# EAGLE design BARBOT (EAGLE 8.6.1)
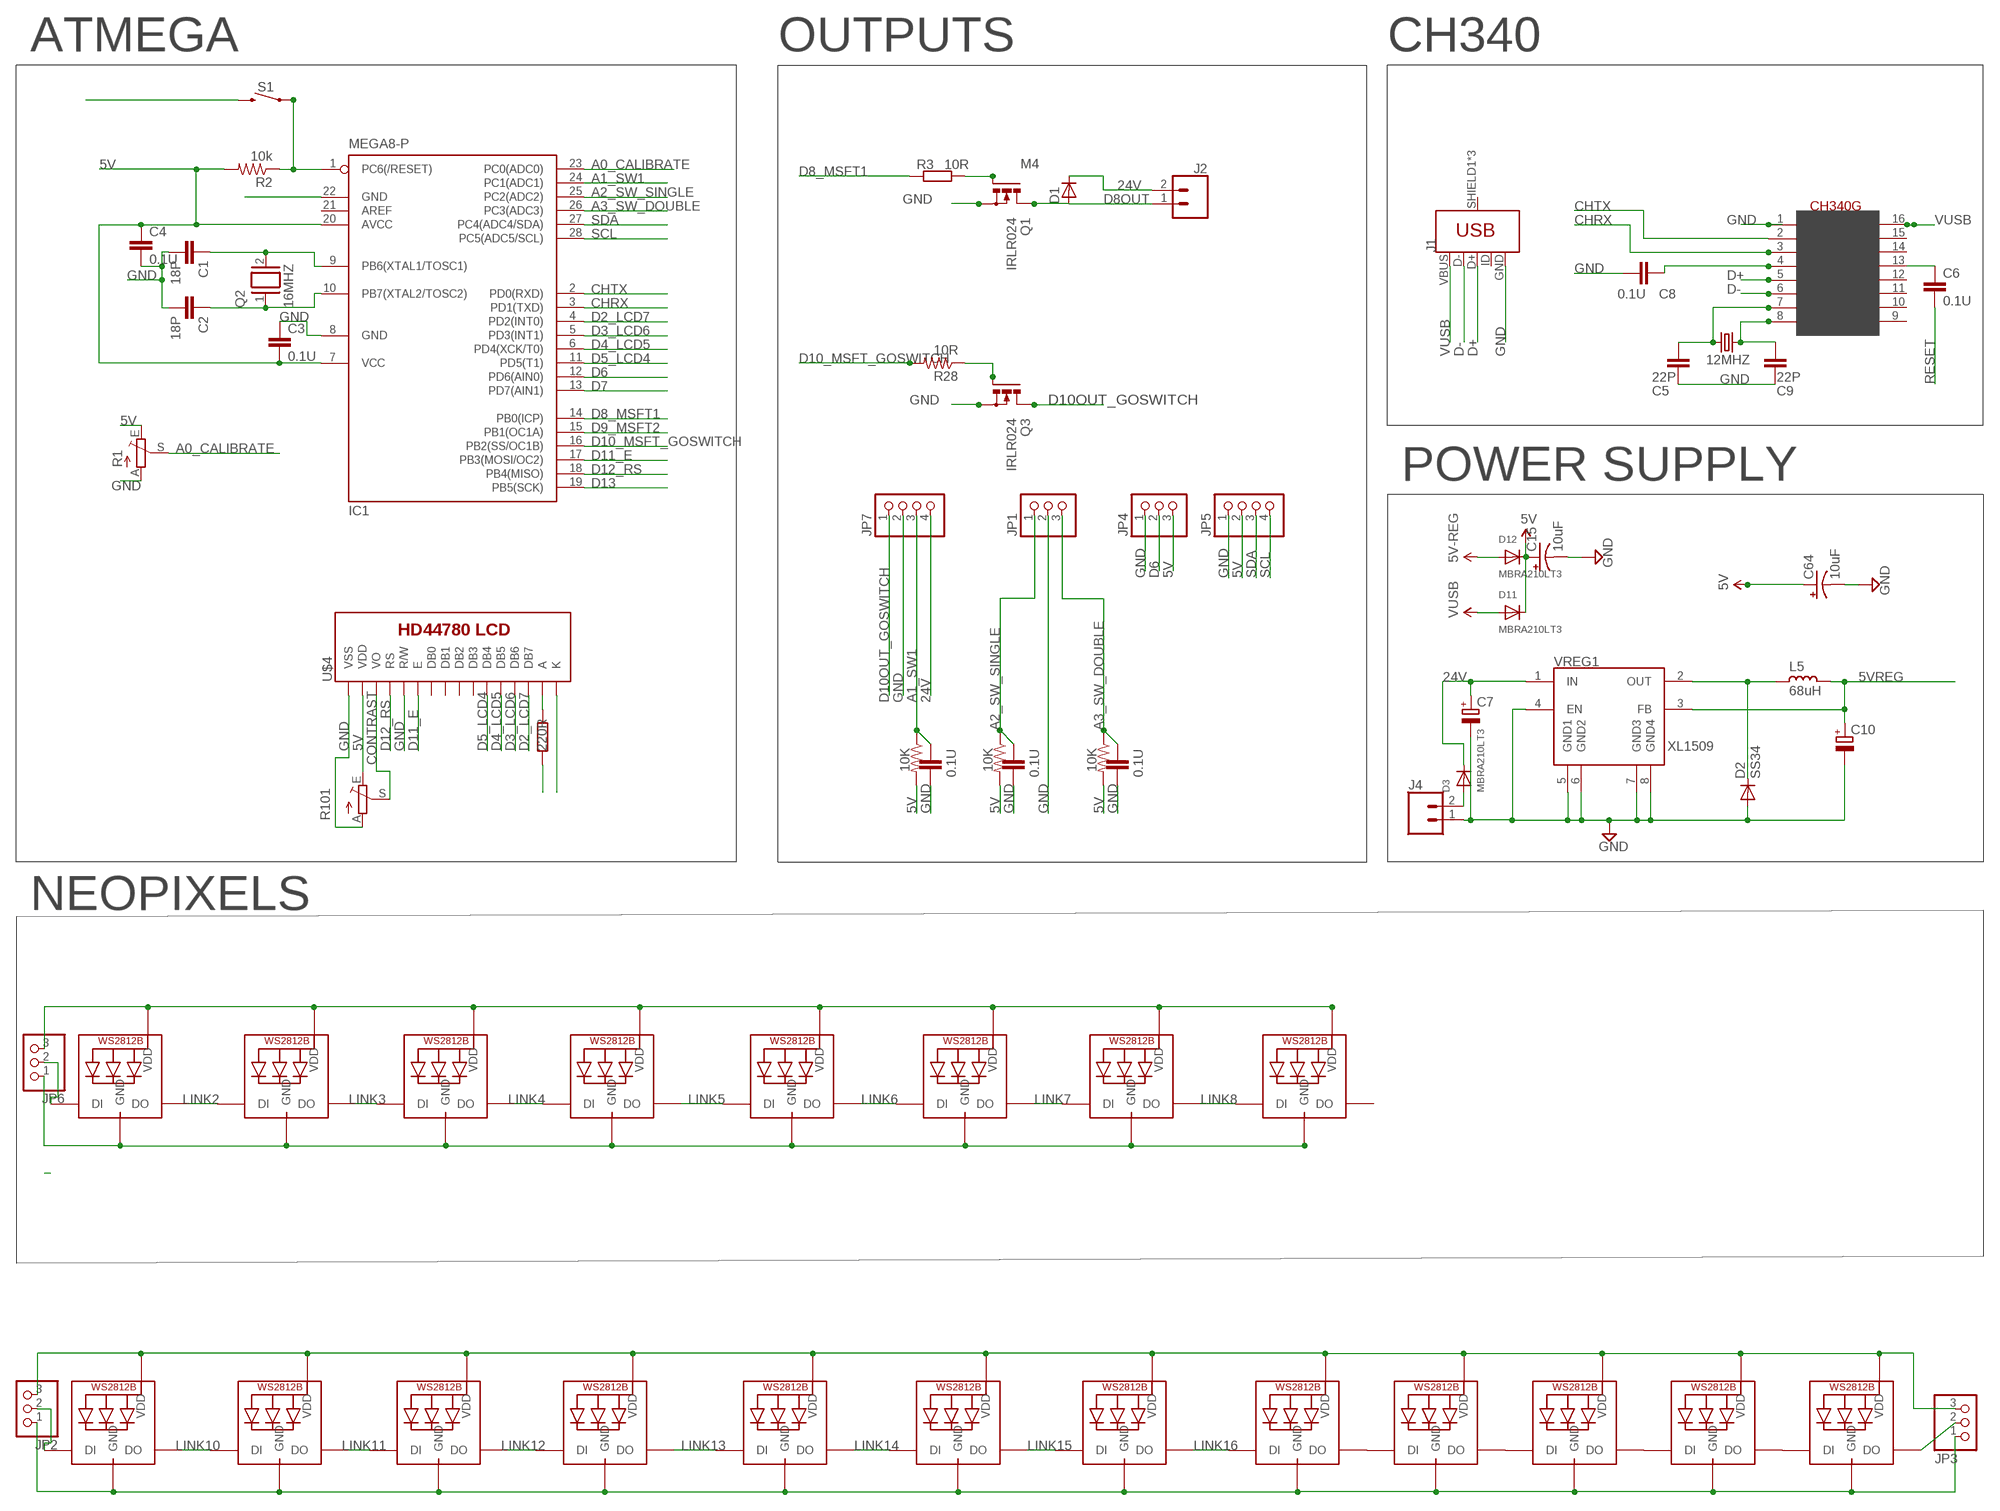
[diagram p0: schematic, sheet 1]

## Parts
12MHZ  12MHZ  CRYSTALHC49U70  [HC49U70]
C1  18P  C-EUC1206  [C1206]
C2  18P  C-EUC1206  [C1206]
C3  0.1U  C-EUC1206  [C1206]
C4  0.1U  C-EUC1206  [C1206]
C5  22P  C-EUC1206  [C1206]
C6  0.1U  C-EUC1206  [C1206]
C7  CPOL-EUE3.5-10  [E3,5-10]
C8  0.1U  C-EUC1206  [C1206]
C9  22P  C-EUC1206  [C1206]
C10  CPOL-EUE3.5-10  [E3,5-10]
C11  0.1U  C-EUC1206  [C1206]
C12  0.1U  C-EUC1206  [C1206]
C13  0.1U  C-EUC1206  [C1206]
C15  10uF  CAP_POL1206  [EIA3216]
C64  10uF  CAP_POL1206  [EIA3216]
D1  M4  D-SOD-80  [SOD80]
D2  SS34  DIODE-DO-214AC  [DO-214AC]
D3  MBRA210LT3  DIODESMA  [SMADIODE]
D11  MBRA210LT3  DIODESMA  [SMADIODE]
D12  MBRA210LT3  DIODESMA  [SMADIODE]
IC1  MEGA8-P  [DIL28-3]
J1  USB_MICRO-BREDUCED_PASTE  [USB-B-MICRO-SMD_RED_PASTE]
J2  CONN_023.5MM  [SCREWTERMINAL-3.5MM-2]
J4  CONN_023.5MM  [SCREWTERMINAL-3.5MM-2]
JP1  PINHD-1X3  [1X03]
JP2  PINHD-1X3  [1X03]
JP3  PINHD-1X3  [1X03]
JP4  PINHD-1X3  [1X03]
JP5  PINHD-1X4  [1X04]
JP6  PINHD-1X3  [1X03]
JP7  PINHD-1X4  [1X04]
L5  68uH  L_CD75  [CD75]
LED1  WS2812B5050  [WS2812B]
LED2  WS2812B5050  [WS2812B]
LED3  WS2812B5050  [WS2812B]
LED4  WS2812B5050  [WS2812B]
LED5  WS2812B5050  [WS2812B]
LED6  WS2812B5050  [WS2812B]
LED7  WS2812B5050  [WS2812B]
LED8  WS2812B5050  [WS2812B]
LED9  WS2812B5050  [WS2812B]
LED10  WS2812B5050  [WS2812B]
LED11  WS2812B5050  [WS2812B]
LED12  WS2812B5050  [WS2812B]
LED13  WS2812B5050  [WS2812B]
LED14  WS2812B5050  [WS2812B]
LED15  WS2812B5050  [WS2812B]
LED16  WS2812B5050  [WS2812B]
LED17  WS2812B5050  [WS2812B]
LED18  WS2812B5050  [WS2812B]
LED19  WS2812B5050  [WS2812B]
LED20  WS2812B5050  [WS2812B]
Q1  IRLR024  N-POWER-MOSFETDPAK-MOSFET  [D-PAK_TO252AA]
Q2  16MHZ  XTAL/S  [QS]
Q3  IRLR024  N-POWER-MOSFETDPAK-MOSFET  [D-PAK_TO252AA]
R1  TRIM_EU-B25P  [B25P]
R2  10k  R-US_R1206  [R1206]
R3  10R  R-EU_R1206  [R1206]
R4  220R  R-EU_R1206  [R1206]
R5  10K  R-US_R1206  [R1206@1]
R6  10K  R-US_R1206  [R1206@1]
R7  10K  R-US_R1206  [R1206@1]
R28  10R  R-US_R1206  [R1206@1]
R101  TRIM_EU-B25P  [B25P]
S1  MOMENTARY-SWITCH-SPST-PTH-RIGHT-ANGLE-KIT  [TACTILE_SWITCH_PTH_RIGHT_ANGLE_KIT]
U$2  CH340G  [SOIC16]
U$4  LCD-HD447804-HOLES16X2-4-HOLES  [LCD-16X2-4HOLES]
VREG1  XL1509  [SO08]

## Nets
5V: C3.2 C4.1 C15.A(+) C64.A(+) D11.C D12.C IC1.7(VCC) IC1.20(AVCC) JP4.3 JP5.2 JP6.3 LED1.1-VDD(VDD) LED2.1-VDD(VDD) LED3.1-VDD(VDD) LED4.1-VDD(VDD) LED5.1-VDD(VDD) LED6.1-VDD(VDD) LED7.1-VDD(VDD) LED8.1-VDD(VDD) R1.E R2.2 R4.1 R5.2 R6.2 R7.2 R101.E U$4.2(VDD)
5V1: JP2.3 JP3.3 LED9.1-VDD(VDD) LED10.1-VDD(VDD) LED11.1-VDD(VDD) LED12.1-VDD(VDD) LED13.1-VDD(VDD) LED14.1-VDD(VDD) LED15.1-VDD(VDD) LED16.1-VDD(VDD) LED17.1-VDD(VDD) LED18.1-VDD(VDD) LED19.1-VDD(VDD) LED20.1-VDD(VDD)
5VREG: C10.+ D12.A L5.1 VREG1.3(FB) ; supply symbol labelled 5V-REG
24V: C7.+ D1.1(C) D3.C J2.2 JP7.4 VREG1.1(IN)
A0_CALIBRATE: IC1.23(PC0(ADC0)) R1.S
A1_SW1: C11.1 IC1.24(PC1(ADC1)) JP7.3 R5.1
A2_SW_SINGLE: C12.1 IC1.25(PC2(ADC2)) JP1.1 R6.1
A3_SW_DOUBLE: C13.1 IC1.26(PC3(ADC3)) JP1.3 R7.1
CHRX: IC1.3(PD1(TXD)) U$2.3(RX)
CHTX: IC1.2(PD0(RXD)) U$2.2(TX)
CONTRAST: R101.S U$4.3(VO)
D2_LCD7: IC1.4(PD2(INT0)) U$4.14(DB7)
D3_LCD6: IC1.5(PD3(INT1)) U$4.13(DB6)
D4_LCD5: IC1.6(PD4(XCK/T0)) U$4.12(DB5)
D5_LCD4: IC1.11(PD5(T1)) U$4.11(DB4)
D6: IC1.12(PD6(AIN0)) JP4.2
D7: IC1.13(PD7(AIN1))
D8_MSFT1: IC1.14(PB0(ICP)) R3.1
D8OUT: D1.2(A) J2.1 Q1.4(D)
D9_MSFT2: IC1.15(PB1(OC1A))
D10_MSFT_GOSWITCH: IC1.16(PB2(SS/OC1B)) R28.2
D10OUT_GOSWITCH: JP7.1 Q3.4(D)
D11_E: IC1.17(PB3(MOSI/OC2)) U$4.6(E)
D12_RS: IC1.18(PB4(MISO)) U$4.4(RS)
D13: IC1.19(PB5(SCK))
D+: J1.D+ U$2.5(D+)
D-: J1.D- U$2.6(D-)
GND: C1.2 C2.2 C3.1 C4.2 C5.2 C7.- C8.2 C9.2 C10.- C11.2 C12.2 C13.2 C15.C(-) C64.C(-) D2.2(A) IC1.8(GND) IC1.22(GND) J1.GND J4.1 JP1.2 JP4.1 JP5.1 JP6.1 JP7.2 LED1.3-GND(GND) LED2.3-GND(GND) LED3.3-GND(GND) LED4.3-GND(GND) LED5.3-GND(GND) LED6.3-GND(GND) LED7.3-GND(GND) LED8.3-GND(GND) Q1.3(S) Q3.3(S) R1.A R101.A S1.2 U$2.1(GND) U$4.1(VSS) U$4.5(R/W) U$4.16(K) VREG1.4(EN) VREG1.5(GND1) VREG1.6(GND2) VREG1.7(GND3) VREG1.8(GND4)
GND1: JP2.1 JP3.1 LED9.3-GND(GND) LED10.3-GND(GND) LED11.3-GND(GND) LED12.3-GND(GND) LED13.3-GND(GND) LED14.3-GND(GND) LED15.3-GND(GND) LED16.3-GND(GND) LED17.3-GND(GND) LED18.3-GND(GND) LED19.3-GND(GND) LED20.3-GND(GND)
LINK1: JP6.2 LED1.4-DIN(DI)
LINK2: LED1.2-DOUT(DO) LED2.4-DIN(DI)
LINK3: LED2.2-DOUT(DO) LED3.4-DIN(DI)
LINK4: LED3.2-DOUT(DO) LED4.4-DIN(DI)
LINK5: LED4.2-DOUT(DO) LED5.4-DIN(DI)
LINK6: LED5.2-DOUT(DO) LED6.4-DIN(DI)
LINK7: LED6.2-DOUT(DO) LED7.4-DIN(DI)
LINK8: LED7.2-DOUT(DO) LED8.4-DIN(DI)
LINK9: JP2.2 LED9.4-DIN(DI)
LINK10: LED9.2-DOUT(DO) LED10.4-DIN(DI)
LINK11: LED10.2-DOUT(DO) LED11.4-DIN(DI)
LINK12: LED11.2-DOUT(DO) LED12.4-DIN(DI)
LINK13: LED12.2-DOUT(DO) LED13.4-DIN(DI)
LINK14: LED13.2-DOUT(DO) LED14.4-DIN(DI)
LINK15: LED14.2-DOUT(DO) LED15.4-DIN(DI)
LINK16: LED15.2-DOUT(DO) LED16.4-DIN(DI)
N$1: Q1.1(G) R3.2
N$2: C6.1 U$2.13(DTR)
N$3: C1.1 IC1.9(PB6(XTAL1/TOSC1)) Q2.2
N$4: D3.A J4.2
N$5: C2.1 IC1.10(PB7(XTAL2/TOSC2)) Q2.1
N$6: JP3.2 LED20.2-DOUT(DO)
N$7: LED16.2-DOUT(DO) LED17.4-DIN(DI)
N$8: LED17.2-DOUT(DO) LED18.4-DIN(DI)
N$9: 12MHZ.1 C5.1 U$2.7(XI)
N$10: R4.2 U$4.15(A)
N$11: 12MHZ.2 C9.1 U$2.8(XO)
N$12: C8.1 U$2.4(V3)
N$17: LED18.2-DOUT(DO) LED19.4-DIN(DI)
N$18: LED19.2-DOUT(DO) LED20.4-DIN(DI)
N$82: Q3.1(G) R28.1
N$292: D2.1(C) L5.2 VREG1.2(OUT)
RESET: C6.2 IC1.1(PC6(/RESET)) R2.1 S1.1
SCL: IC1.28(PC5(ADC5/SCL)) JP5.4
SDA: IC1.27(PC4(ADC4/SDA)) JP5.3
VUSB: D11.A J1.VBUS U$2.16(VCC)
Unconnected: IC1.21(AREF) J1.ID J1.SHIELD1(SHIELD) J1.SHIELD2(SHIELD) J1.SHIELD3(SHIELD) LED8.2-DOUT(DO) U$2.9(CTS) U$2.10(DSR) U$2.11(RI) U$2.12(DCD) U$2.14(RTS) U$2.15(RS232) U$4.7(DB0) U$4.8(DB1) U$4.9(DB2) U$4.10(DB3)

## Notes on the sheet
- ATMEGA | OUTPUTS | CH340
- POWER SUPPLY
- NEOPIXELS

## Library data of the parts
12MHZ = crystal:CRYSTAL: CRYSTAL; OC_FARNELL: unknown; OC_NEWARK: unknown
C1-C6 C8 C9 C11-C13 = rcl:C-EU: CAPACITOR, European symbol; SPICEPREFIX: C
C7 C10 = rcl:CPOL-EU: POLARIZED CAPACITOR, European symbol; SPICEPREFIX: C
C15 C64 = SparkFun:CAP_POL: Capacitor Polarized These are standard SMD and PTH capacitors. Normally 10uF, 47uF, and 100uF in electrolytic and tantalum varieties. Always verify the external diameter of the through hole cap, it varies with capacity, voltage, and manufacturer. The EIA devices should be standard.
D1 = semicon-smd-ipc:D-: DIODE unfilled
D2 = dp_devices:DIODE: Various Diode Packages
D3 D11 D12 = microbuilder:DIODE: Diode SMADIODE - SMA Surface Mount Package 20V 1A Schottky Diode Digikey (500mV @ 1A, 500uA Vr @ 20V): 641-1014-6-ND 10V 2A Schottky Diode Digikey (350mV @ 2A, 700uA Vr @ 10V): MBRA210LT3 SOD-123 30V 200mA (800mV Vf, 2uA Vr @ 25V) Schottky Diode (very fast switching for boost, etc.) - Digikey: BAT54T1GOSTR-ND 30V 500mA (430mV Vf, 130uA Vr @ 30V) Schottky Diode - Digikey: B0530W-FDICT-ND MBR120 1A 20V (0.34Vf) Schottky Diode - Digikey: MBR120VLSFT1GOSCT-ND SOD-323 10V 570mA (380mV Vf, 3ns) Schottky Diode - Digikey: ZLLS410CT-ND 1N4148WS - 75V 150mA (1V Vf @ 10mA, 4ns) Simple Diode - Digikey: 1N4148WSFSCT-ND, Mouser: 512-1N4148WS SOD-523 BAT54 30V 200mA Schottky (0.8 Vf @ 100mA, 5ns) - Digikey: BAT54XV2CT-ND 30V 30mA Schottky Diode (RB751S-40TE61) - Digikey: RB751S-40TE61CT-ND SOT23-R/W - SOT23 Package (R = Solder Paste/Reflow Ovens, W = Hand-Soldering) BAT54Film 40V 300mA - Digikey: 497-7162-1-ND DO-1N4148 Through Hole Small Current Diode (any model)
IC1 = atmel:MEGA8-P: MICROCONTROLLER 8 Kbytes FLASH, 1 kbytes SRAM, 512 bytes EEPROM, USART, 4-channel 10 bit ADC, 2-channel 8 bit ADC Pin compatible with Atmega48, ATMega88, ATMega168 Source: avr.lbr; OC_FARNELL: unknown; OC_NEWARK: unknown
J1 = SparkFun-Connectors:USB_MICRO-B: USB Type Micro-B Connector Male/female and PTH/SMT variants SparkFun Products: SparkFun microB USB Breakout <https://www.sparkfun.com/products/12035> SparkFun USB microB Plug Breakout <https://www.sparkfun.com/products/10031> SparkFun ESP8266 Thing <https://www.sparkfun.com/products/13231>; PROD_ID: CONN-11752
J2 J4 = SparkFun-Connectors:CONN_02: Multi connection point. Often used as Generic Header-pin footprint for 0.1 inch spaced/style header connections On any of the 0.1 inch spaced packages, you can populate with these: Break Away Headers - Straight <https://www.sparkfun.com/products/116> (PRT-00116) Break Away Male Headers - Right Angle <https://www.sparkfun.com/products/553> (PRT-00553) Female Headers <https://www.sparkfun.com/products/115> (PRT-00115) Break Away Headers - Machine Pin <https://www.sparkfun.com/products/117> (PRT-00117) Break Away Female Headers - Swiss Machine Pin <https://www.sparkfun.com/products/743> (PRT-00743) For SCREWTERMINALS and SPRING TERMINALS visit here: Screw Terimnals on SparkFun.com <https://www.sparkfun.com/search/results?term=Screw+Terminals> (5mm/3.5mm/2.54mm spacing) This device is also useful as a general connection point to wire up your design to another part of your project. Our various solder wires solder well into these plated through hole pads. Hook-Up Wire - Assortment (Stranded, 22 AWG) <https://www.sparkfun.com/products/11375> (PRT-11375) Hook-Up Wire - Assortment (Solid Core, 22 AWG) <https://www.sparkfun.com/products/11367> (PRT-11367) View the entire wire category on our website here <https://www.sparkfun.com/categories/141> Special notes: Molex polarized connector foot print use with: PRT-08233 with associated crimp pins and housings. 2.54_SCREWTERM for use with PRT-10571. 3.5mm Screw Terminal footprints for PRT-08084 5mm Screw Terminal footprints for use with PRT-08432; PROD_ID: CONN-08399
JP1-JP4 JP6 = pinhead:PINHD-1X3: PIN HEADER
JP5 JP7 = pinhead:PINHD-1X4: PIN HEADER
L5 = rc-master-smd:L_: INDUCTOR
LED1-LED20 = adafruit:WS2812B
Q1 Q3 = Cohesion_parts:N-POWER-MOSFET
Q2 = special:XTAL/S: CRYSTAL
R1 R101 = pot:TRIM_EU-: POTENTIOMETER
R2 = resistor:R-US_: RESISTOR, American symbol
R3 R4 = resistor:R-EU_: RESISTOR, European symbol
R5-R7 R28 = rcl:R-US_: RESISTOR, American symbol
S1 = SparkFun-Switches:MOMENTARY-SWITCH-SPST: Momentary Switch (Pushbutton) - SPST Normally-open (NO) SPST momentary switches (buttons, pushbuttons). Variants PTH-12MM - 12mm square, through-hole Momentary Pushbutton Switch - 12mm Square <https://www.sparkfun.com/products/9190> (COM-09190) PTH-6.0MM, PTH-6.0MM-KIT - 6.0mm square, through-hole Mini Pushbutton Switch <https://www.sparkfun.com/products/97> (COM-00097) KIT package intended for soldering kit's - only one side of pads' copper is exposed. PTH-RIGHT-ANGLE-KIT - Right-angle, through-hole Right Angle Tactile Button <https://www.sparkfun.com/products/10791> - Used on SparkFun BigTime Watch Kit <https://www.sparkfun.com/products/11734> SMD-12MM - 12mm square, surface-mount Tactile Button - SMD (12mm) <https://www.sparkfun.com/products/12993> (COM-12993) Used on SparkFun PicoBoard <https://www.sparkfun.com/products/11888> SMD-4.5MM - 4.5mm Square Trackball Switch Used on SparkFun Blackberry Trackballer Breakout <https://www.sparkfun.com/products/13169> SMD-4.6MMX2.8MM - 4.60mm x 2.80mm, surface mount Used on SparkFun SAMD21 Mini Breakout <https://www.sparkfun.com/products/13664> SMD-5.2MM, SMD-5.2-REDUNDANT - 5.2mm square, surface-mount Mini Pushbutton Switch - SMD <https://www.sparkfun.com/products/8720> (COM-08720) Used on Arduino Pro Mini <https://www.sparkfun.com/products/11114> REDUNDANT package connects both switch circuits together SMD-6.0X3.5MM - 6.0 x 3.5mm, surface mount Momentary Reset Switch SMD <https://www.sparkfun.com/products/8229> (COM-08229) SMD-6.2MM-TALL - 6.2mm square, surface mount Tactile Button - SMD (6mm) <https://www.sparkfun.com/products/12992> Used on SparkFun Digital Sandbox <https://www.sparkfun.com/products/12651> SMD-RIGHT-ANGLE - Right-angle, surface mount Used on SparkFun Block for Intel® Edison - Arduino <https://www.sparkfun.com/products/13036>; PROD_ID: CONN-10672; SF_SKU: COM-10791
U$2 = usb-serial:CH340G
U$4 = HD44780LCD:LCD-HD44780
VREG1 = Cohesion_parts:XL1509

## Net classes
0 default: width 0.254 mm, clearance 0.254 mm
1 power: width 0.6 mm, clearance 0.305 mm
5 3.3-Amp Class: width 1.27 mm

## Board
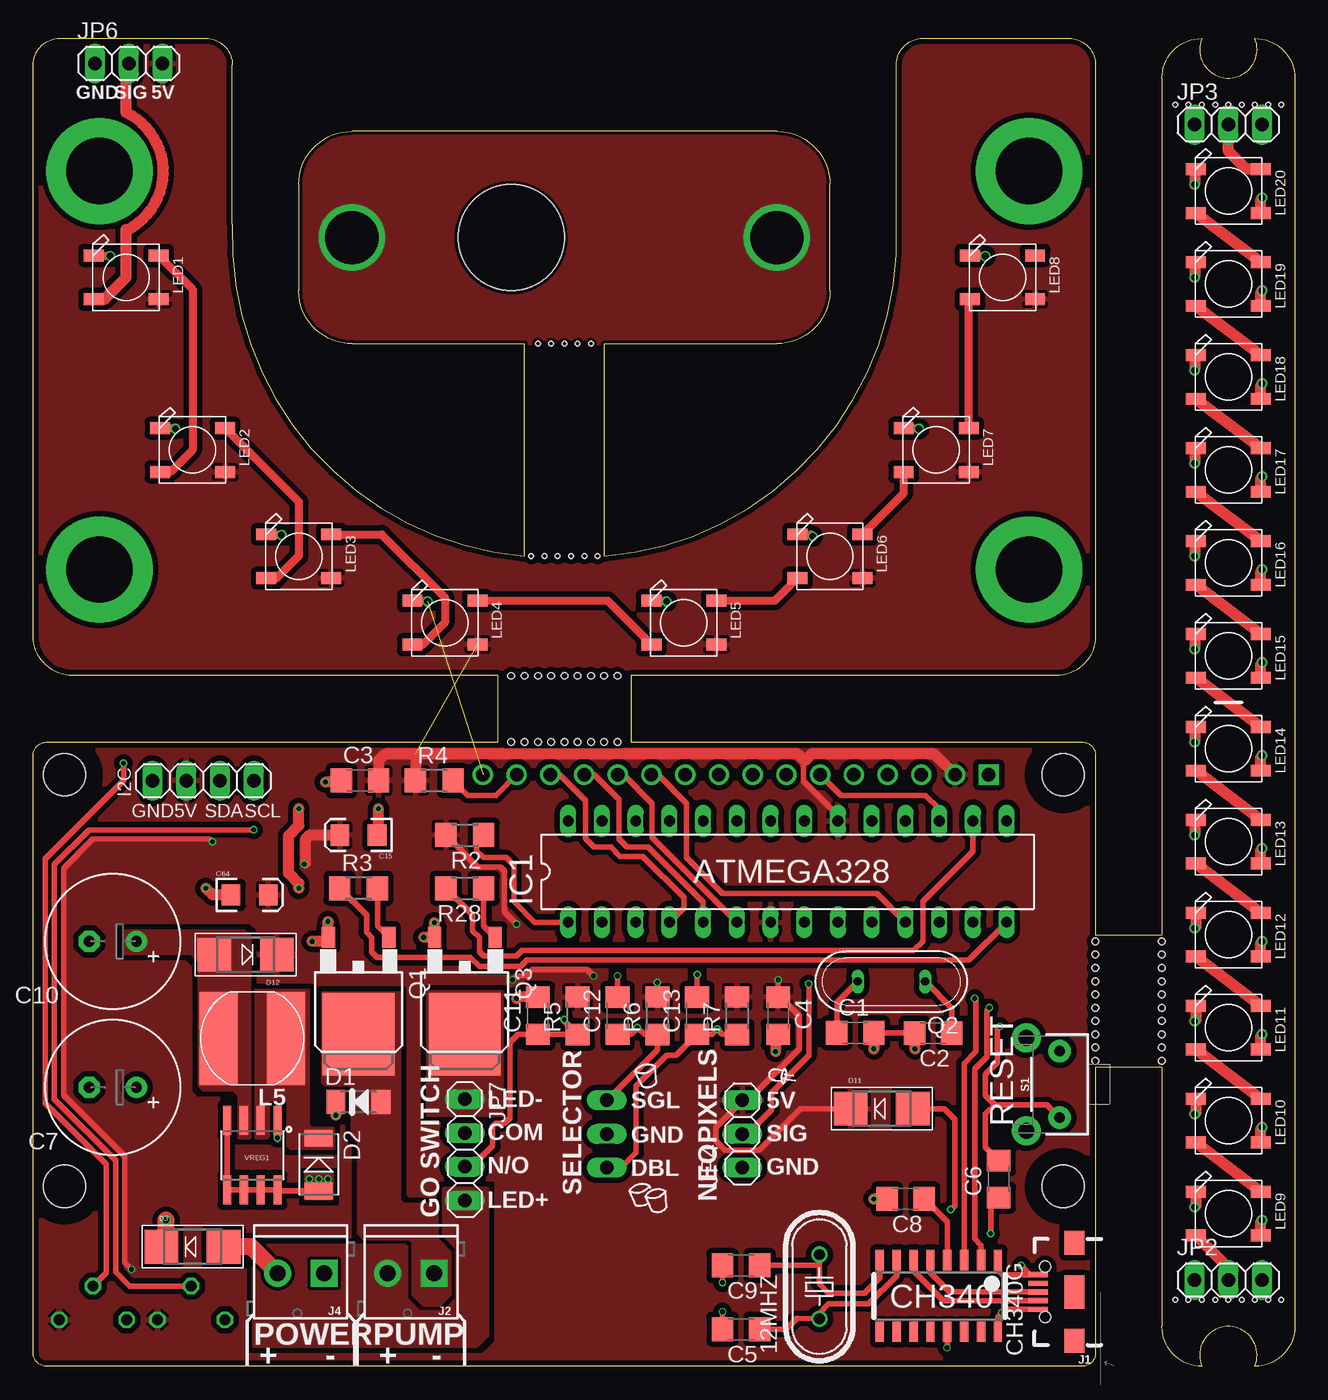
[diagram p1: board, top side]
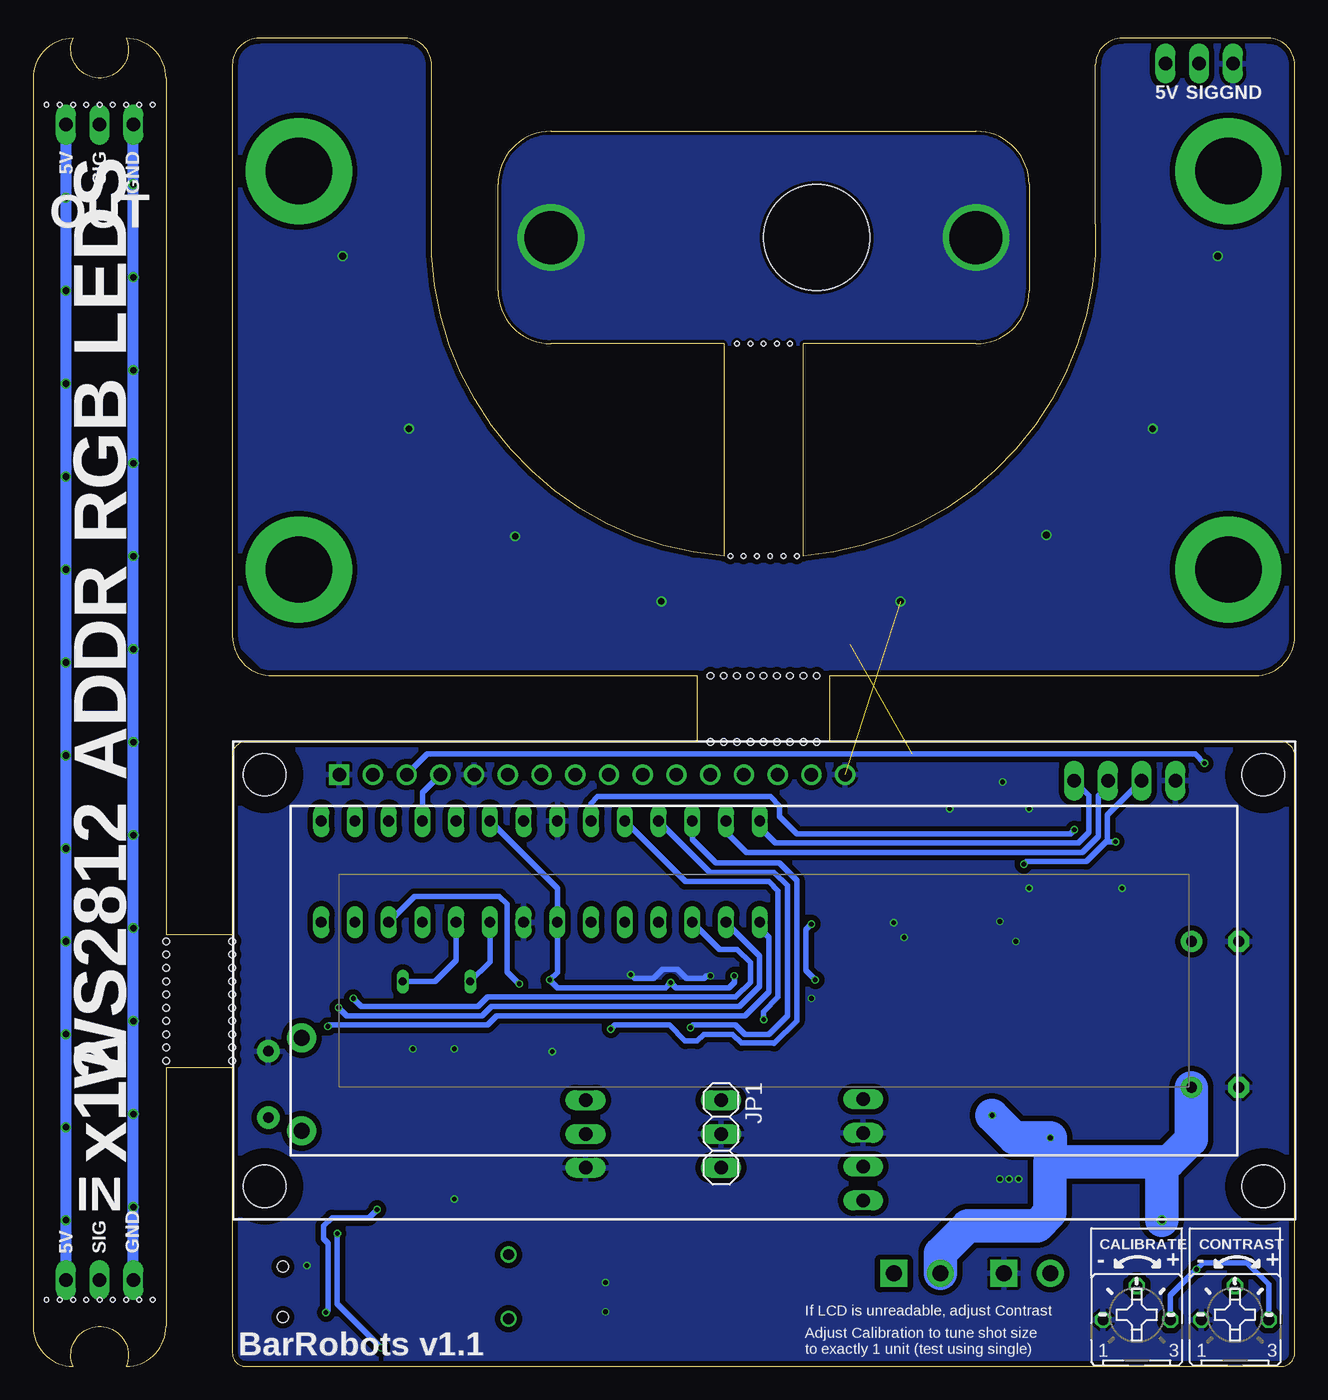
[diagram p2: board, bottom side, seen from below]

Size 95 x 100 mm. Coordinates in mm from the lower left corner, seen from the top.
Outline: 85,3 85,22.5 80,22.5 80,1 arc-90 79,0 1,0 arc-90 0,1 0,46 arc-90 1,47 35,47 35,52 3,52 arc-90 0,55 0,98 arc-90 2,100 13,100 arc-90 15,98 15,86 arc87 37,61 37,77 24,77 arc-90 20,81 20,89 arc-90 24,93 56,93 arc-90 60,89 60,81 arc-90 56,77 43,77 43,61 arc88 65,86 65,98 arc-90 67,100 78,100 arc-90 80,98 80,55 arc-90 77,52 45,52 45,47 79,47 arc-90 80,46 80,32.5 85,32.5 85,97 arc-90 88,100 arc225 92,100 arc-90 95,97 95,3 arc-90 92,0 arc225 88,0
Outline: 88,0 arc-90 85,3
Outline: 88,0 arc-90 85,3
Copper layers (1*16): Top 0.035mm / dielectric 0.2mm / Bottom 0.035mm
Design rules "SeeedStudio_4layer_DRU_no_angle_20140221 *": minimum track width 8mil, minimum drill 12mil, track to track 8mil, track to pad 8mil, pad to pad 8mil, via to via 8mil, smd to smd 0mil, copper to edge 10mil, drill to drill 8mil, minimum pad ring 6mil, minimum via ring 4mil, stop-mask expansion 4mil, vias tented up to drill 25mil, thermal gap 10mil
Holes 0.5 mm at 36,47 37,47 38,47 40,47 41,47 42,47 43,47 44,47 44,52 43,52 42,52 41,52 40,52 38,52 37,52 36,52 39,47 39,52 85,23 85,24 85,25 85,26 85,27 85,28 85,29 85,30 85,31 85,32 80,23 80,24 80,25 80,26 80,27 80,28 80,29 80,30 80,31 80,32
Holes 8 mm at 36,85
Holes 0.35 mm at 38,77 39,77 40,77 41,77 42,77 37.5,61 38.5,61 39.5,61 40.5,61 41.5,61 42.5,61 93,5 92,5 91,5 90,5 89,5 88,5 87,5 86,5 94,5 94,95 93,95 92,95 91,95 90,95 89,95 88,95 87,95 86,95
tRestrict: area 0.4,11.6 to 4.3,15.5; area 75.6,11.6 to 79.5,15.5; area 75.6,42.6 to 79.5,46.5; area 0.4,42.6 to 4.3,46.5
bRestrict: area 75.6,42.6 to 79.5,46.5; area 75.6,11.6 to 79.5,15.5; area 0.4,11.6 to 4.3,15.5; area 0.4,42.6 to 4.3,46.5

### Footprints (pad centres in the part's own frame; a part is rotated, then mirrored left to right if it is on the bottom)
HC49U70 = drill 0.813: 1 -2.413,0; 2 2.413,0
C1206 = smd 1.6 x 1.8: 1 -1.4,0; 2 1.4,0
E3,5-10 = drill 0.813 pad 1.6: + -1.778,0 | drill 0.813 pad 1.6 octagon: - 1.778,0
EIA3216 = smd 1.4 x 1.6: A 1.4,0; C -1.4,0
SOD80 = smd 1.4 x 1.8: 1 -1.7,0; 2 1.7,0
DO-214AC = smd 1.27 x 2.1: 1 -1.98,0; 2 1.98,0
SMADIODE = smd 2.54 x 2.54: A 2.349,0; C -2.349,0
DIL28-3 = drill 0.813 long: 1 -16.51,-3.81; 2 -13.97,-3.81; 3 -11.43,-3.81; 4 -8.89,-3.81; 5 -6.35,-3.81; 6 -3.81,-3.81; 7 -1.27,-3.81; 8 1.27,-3.81; 9 3.81,-3.81; 10 6.35,-3.81; 11 8.89,-3.81; 12 11.43,-3.81; 13 13.97,-3.81; 14 16.51,-3.81; 15 16.51,3.81; 16 13.97,3.81; 17 11.43,3.81; 18 8.89,3.81; 19 6.35,3.81; 20 3.81,3.81; 21 1.27,3.81; 22 -1.27,3.81; 23 -3.81,3.81; 24 -6.35,3.81; 25 -8.89,3.81; 26 -11.43,3.81; 27 -13.97,3.81; 28 -16.51,3.81
USB-B-MICRO-SMD_RED_PASTE = smd 1.45 x 0.4: D+ 2.725,0; D- 2.725,0.65; GND 2.725,-1.3; ID 2.725,-0.65; VBUS 2.725,1.3 | smd 1.5 x 1.8: SHIELD1 0,3.685; SHIELD2 0,-3.685 | smd 1.5 x 2.5: SHIELD3 0,0 | hole 0.85: 2.2,1.9; 2.2,-1.9
SCREWTERMINAL-3.5MM-2 = drill 1.2 pad 2.032 square: 1 0,0 | drill 1.2 pad 2.032: 2 3.5,0
1X03 = drill 1.016 long: 1 -2.54,0; 2 0,0; 3 2.54,0
1X04 = drill 1.016 long: 1 -3.81,0; 2 -1.27,0; 3 1.27,0; 4 3.81,0
CD75 = smd 7 x 2.85: 1 0,2.54; 2 0,-2.54
WS2812B = smd 1.5 x 0.9: 1-VDD 2.45,-1.65; 2-DOUT 2.45,1.65; 3-GND -2.45,1.65; 4-DIN -2.45,-1.65
D-PAK_TO252AA = smd 1 x 1.6: 1 -2.28,-4.8; 3 2.28,-4.8 | smd 5.4 x 6.2: 4 0,2.5
QS = drill 0.61 long: 1 -2.54,0; 2 2.54,0
B25P = drill 0.813 octagon: A -2.54,0; E 2.54,0; S 0,2.54
R1206 = smd 1.6 x 1.803: 1 -1.422,0; 2 1.422,0
R1206@1 = smd 1.6 x 1.803: 1 -1.422,0; 2 1.422,0
TACTILE_SWITCH_PTH_RIGHT_ANGLE_KIT = drill 0.8 pad 1.7: 1 -2.5,0; 2 2.5,0 | drill 1.2 pad 2.2: ANCHOR1 -3.5,2.5; ANCHOR2 3.5,2.5
SOIC16 = smd 0.635 x 1.524: 1 -4.445,-2.695; 2 -3.175,-2.695; 3 -1.905,-2.695; 4 -0.635,-2.695; 5 0.635,-2.695; 6 1.905,-2.695; 7 3.175,-2.695; 8 4.445,-2.695; 9 4.445,2.695; 10 3.175,2.695; 11 1.905,2.695; 12 0.635,2.695; 13 -0.635,2.695; 14 -1.905,2.695; 15 -3.175,2.695; 16 -4.445,2.695
LCD-16X2-4HOLES = drill 1.016 square: 1 -32,15.5 | drill 1.016: 2 -29.46,15.5; 3 -26.92,15.5; 4 -24.38,15.5; 5 -21.84,15.5; 6 -19.3,15.5; 7 -16.76,15.5; 8 -14.22,15.5; 9 -11.68,15.5; 10 -9.14,15.5; 11 -6.6,15.5; 12 -4.06,15.5; 13 -1.52,15.5; 14 1.02,15.5; 15 3.56,15.5; 16 6.1,15.5 | hole 3.2: -37.6,15.5; -37.6,-15.5; 37.6,-15.5; 37.6,15.5
SO08 = smd 0.61 x 2.21: 1 -1.905,-2.616; 2 -0.635,-2.616; 3 0.635,-2.616; 4 1.905,-2.616; 5 1.905,2.616; 6 0.635,2.616; 7 -0.635,2.616; 8 -1.905,2.616

### Placement (x,y rotation side)
12MHZ  59.2,6 90 top
C1  61.91,25.11 0 top
C2  67.77,25.09 180 top
C3  24.61,44.11 0 top
C4  56.1,26.4 270 top
C5  53.3,2.8 180 top
C6  72.7,14.1 90 top
C7  6,21 180 top
C8  65.7,12.6 180 top
C9  53.3,7.6 180 top
C10  6,32 180 top
C11  38,26.4 90 top
C12  44,26.4 90 top
C13  50,26.4 90 top
C15  24.5,40 180 top
C64  16.3,35.5 0 top
D1  24.5,19.9 0 top
D2  21.5,15.2 270 top
D3  12,9 0 top
D11  63.9,19.4 0 top
D12  16,31 180 top
IC1  56.8,37.25 0 top
J1  78.4,5.6 180 top
J2  30.2,7 180 top
J4  21.9,7 180 top
JP1  43.2,17.5 270 bottom
JP2  90,6.5 0 top
JP3  90,93.5 0 top
JP4  53.4,17.5 90 top
JP5  12.8,44.1 0 top
JP6  7.2,98.1 0 top
JP7  32.5,16.3 270 top
L5  16.5,24.7 90 top
LED1  7,82 0 top
LED2  12,69 0 top
LED3  20,61 0 top
LED4  31,56 0 top
LED5  49,56 0 top
LED6  60,61 0 top
LED7  68,69 0 top
LED8  73,82 0 top
LED9  90,11.5 0 top
LED10  90,18.5 0 top
LED11  90,25.5 0 top
LED12  90,32.5 0 top
LED13  90,39.5 0 top
LED14  90,46.5 0 top
LED15  90,53.5 0 top
LED16  90,60.5 0 top
LED17  90,67.5 0 top
LED18  90,74.5 0 top
LED19  90,81.5 0 top
LED20  90,88.5 0 top
Q1  24.5,27.5 180 top
Q2  64.63,28.97 180 top
Q3  32.5,27.5 180 top
R1  11.9,3.5 0 bottom
R2  32.5,40 180 top
R3  24.5,36 0 top
R4  30.2,44.1 0 top
R5  41,26.4 90 top
R6  47,26.4 90 top
R7  53,26.4 90 top
R28  32.5,36 180 top
R101  4.5,3.5 0 bottom
S1  77.29,21.23 90 top
U$2  68.2,5.3 180 top
U$4  39.96,29.05 0 bottom
VREG1  16.5,15.9 180 top

### Tracks (layer width: path | path; a pad name or v marks a point on that pad's centre or on a via)
5V  (via drill 0.35)  (1 unrouted)
  Top 0.406: C3.2 | 58.1,45.6 58,45.5 58,44.09 60.61,41.48 IC1.20 | v56.1,29.1 56.1,28 | 56.1,28 C4.1 | v47,28.9 R6.2 | 55.92,27.82 56.1,28 | R2.2 33.48,37.6 35.2,37.6 35.5,37.3 35.5,34.2 v36.4,33.3 | v36.1,29.1 36.4,29.4 37.1,29.4 37.6,29.9 41.7,29.9 v42.2,29.4 | 28.8,46.1 28.78,46.08 | v20.4,37.8 20.5,37.9 | 56.1,28 57.7,26.4 57.7,23.9 53.84,20.04 JP4.3 53.4,19.99 51.42,18 51.42,17 52.13,16.28 54.67,16.28 57.79,19.4 D11.C | v13.5,39.5 13.3,39.7 4.5,39.7 2.3,37.5 2.3,20.4 6.9,15.8 6.9,7.8 v7.4,7.3
  Top 0.813: U$4.2 67.87,46.1 58.6,46.1 58.1,45.6 57.6,46.1 28.8,46.1 26.5,46.1 26.01,45.61 C3.2 | 28.78,46.08 R4.1 | 20.5,37.9 20.5,39.7 20.8,40 C15.A
  Bottom 0.406: IC1.20 55.53,35.98 IC1.7 55.53,29.67 v56.1,29.1 55.5,28.5 47.4,28.5 v47,28.9 46.6,28.5 42.6,28.5 42.2,28.9 v42.2,29.4 | v36.4,33.3 36.8,32.9 36.8,29.8 v36.1,29.1 | JP5.2 14.1,41.53 14.1,39.6 | 14.1,39.6 15.7,38 20.2,38 v20.4,37.8 | v13.5,39.5 14,39.5 14.1,39.6 | R1.E 9.36,5.34 v7.4,7.3 6.9,7.8 3.6,7.8 1.96,6.16 R101.E
  pour Top (isolate 0.406, rank 6): 0,47 79,47 80,46 80,1 79,0 1,0 0,1
  pour Top (isolate 0.406, rank 6): 2,52 77,52 80,55 80,98 78,100 67,100 65,98 65,84 arc-171 15,84 15,98 13,100 2,100 0,98 0,54
5V1  (via drill 0.5)
  Top 0.813: LED9.1-VDD 92.45,10.91 v92.54,11 | LED10.1-VDD 92.45,17.91 v92.54,18 | LED11.1-VDD 92.45,24.91 v92.54,25 | LED12.1-VDD 92.45,31.91 v92.54,32 | LED13.1-VDD 92.45,38.91 v92.54,39 | LED14.1-VDD 92.45,45.91 v92.54,46 | LED15.1-VDD 92.45,52.91 v92.54,53 | LED16.1-VDD 92.45,59.91 v92.54,60 | LED17.1-VDD 92.45,66.91 v92.54,67 | LED18.1-VDD 92.45,73.91 v92.54,74 | LED19.1-VDD 92.45,80.91 v92.54,81 | LED20.1-VDD 92.45,87.91 v92.54,88
  Bottom 0.813: JP3.3 v92.54,88 v92.54,81 v92.54,74 v92.54,67 v92.54,60 v92.54,53 v92.54,46 v92.54,39 v92.54,32 v92.54,25 v92.54,18 v92.54,11 JP2.3
5VREG
  pour Top (rank 2, no thermals): 16.3,17.2 16.3,32.4 15.9,32.8 6.8,32.8 6.8,31.1 11.9,31.1 12.5,30.5 12.5,21.1 12.8,20.8 15.1,20.8 15.5,20.4 15.5,17.2
24V  (via drill 0.35, 0.5)
  Top 0.61: v18.4,17.2 VREG1.1
  Top 0.813: D1.1 v22.8,18.9
  Top 1.27: D3.C 10,9.35 v10,11
  Bottom 1.27: 7.8,20.98 C7.+ | 10,14.9 9.5,15.4 | 18.43,15.37 18.4,15.4
  Bottom 2.54: 7.8,20.98 7.8,17.1 9.5,15.4 18.4,15.4 v18.4,17.2 21.1,17.2 v22.8,18.9 | v10,11 10,14.9 | J2.2 26.7,8.5 24.62,10.58 19.39,10.58 18.43,11.54 18.43,15.37
  pour Top (rank 2, no thermals): 30.9,13.4 30.9,9.9 31.9,8.9 31.9,5.1 31,4.2 30.9,4.1 29.1,4.1 28.1,5.1 28.1,9 28,9.1 16.6,9.1 16.6,1.5 33.4,1.5 33.6,1.7 34.2,2.3 34.2,4.6 34.2,13.4
A0_CALIBRATE  (via drill 0.35)
  Top 0.406: R1.S 7.26,6.04 6.2,7.1 6.2,15.5 1.6,20.1 1.6,37.8 4.2,40.4 v16.6,40.4
  Bottom 0.406: IC1.23 53,41.1 53,42.4 52.5,42.9 39.5,42.9 38.8,42.2 38.8,41.4 37.5,40.1 16.9,40.1 v16.6,40.4
A1_SW1  (via drill 0.35)
  Top 0.406: 38,25.2 C11.1 | v40,26.1 40,25.98 R5.1 40.98,25 C11.1 | JP7.3 33.03,15.03 34.6,16.6 34.6,18.1 34.8,18.3 35.5,18.3 35.9,18.7 35.9,24.4 36.5,25 C11.1
  Bottom 0.406: IC1.24 45.89,36.5 39.6,36.5 38.9,35.8 38.9,27.8 40,26.7 v40,26.1
A2_SW_SINGLE  (via drill 0.35)
  Top 0.406: C12.1 45,25 v45.5,25.5 46.02,24.98 R6.1 47,23.84 JP1.1
  Bottom 0.406: IC1.25 44.05,37.2 39.2,37.2 38.2,36.2 38.2,27.9 38.2,26.4 39.6,25 41.4,25 42.1,25.7 45.3,25.7 v45.5,25.5
A3_SW_DOUBLE  (via drill 0.35)
  Top 0.406: R7.1 52.98,25 51.9,25 v51.5,25.4 51.1,25 C13.1 48.4,23.4 47.7,23.4 45.4,21.1 45.4,16.1 44.26,14.96 JP1.3
  Bottom 0.406: IC1.26 45.37,39.67 43.6,37.9 38.8,37.9 37.5,36.6 37.5,26 39.2,24.3 39.24,24.34 41.67,24.34 42.33,25 44.5,25 45,24.5 45.9,24.5 47.1,25.7 51.2,25.7 v51.5,25.4
CHRX  (via drill 0.35)
  Top 0.406: U$2.3 70.11,22.8 71,23.7 71,27.6 v70.9,27.7
  Bottom 0.406: IC1.3 43.33,31.4 42,31.4 41,30.4 41,28.9 42.1,27.8 60.8,27.8 61.5,27.1 70.3,27.1 v70.9,27.7
CHTX  (via drill 0.35)
  Top 0.406: U$2.2 71.38,9.12 70.9,9.6 70.9,22.4 71.8,23.3 71.8,26.8 v72,27
  Bottom 0.406: IC1.2 40.3,30.91 40.3,28.6 41.8,27.1 60.5,27.1 61.2,26.4 71.4,26.4 v72,27
CONTRAST  (via drill 0.35)
  Top 0.406: R101.S 5.5,7.04 5.5,15.2 0.9,19.8 0.9,38.2 6.8,44.1 v6.8,45.4
  Bottom 0.406: U$4.3 65.33,46.1 7.5,46.1 v6.8,45.4
D2_LCD7
  Top 0.406: U$4.14 39.65,44.55 41.6,42.6 41.6,39.75 42.25,39.1 43.5,39.1 44.2,38.4 45.9,38.4 49,35.3 49,34.53 IC1.4
D3_LCD6
  Top 0.406: U$4.13 42.25,44.55 44.1,42.7 44.1,39.7 44.7,39.1 46.3,39.1 50.45,34.95 IC1.5
D4_LCD5
  Top 0.406: U$4.12 44.45,44.55 46.6,42.4 46.6,39.83 IC1.6
D5_LCD4
  Top 0.406: IC1.11 63.53,35.6 51.9,35.6 49.2,38.3 49.2,42.4 47.05,44.55 U$4.11
D6  (via drill 0.35)
  Top 0.406: v58.4,28.8 58.4,23.4 55.6,20.6 55.6,19.3 53.8,17.5 JP4.2
  Bottom 0.406: v58.4,28.8 59.3,29.7 59.3,34.8 59.9,35.4 66.27,35.4 IC1.12
D8_MSFT1
  Top 0.406: IC1.14 70.47,30.6 37.2,30.6 36.7,30.1 33.6,30.1 32.9,30.8 25.9,30.8 25.5,31.2 25.5,32.3 25.1,32.7 25.1,33.98 R3.1
D8OUT
  pour Top (rank 3, no thermals): 21.8,28.1 21.8,21.4 22,21.2 23.8,21.2 24,21 24,17.4 24.5,16.9 24.5,10 24.9,9.6 28.3,9.6 28.6,9.3 28.6,5.3 29.3,4.6 30.7,4.6 31.4,5.3 31.4,8.7 30.4,9.7 30.4,12.2 27.9,12.2 27.6,12.5 27.6,28.1
D10_MSFT_GOSWITCH
  Top 0.406: IC1.16 70.77,38.77 67,35 67,32 66.3,31.3 36.8,31.3 36.4,30.9 33.9,30.9 33.6,31.2 33.6,32.3 33.1,32.8 33.1,33.98 R28.2
D10OUT_GOSWITCH
  pour Top (rank 3, no thermals): 29.7,18.9 35.3,18.9 35.3,28.2 29.7,28.2
D11_E
  Top 0.406: IC1.17 68.23,41.97 67.2,43 60.81,43 U$4.6
D12_RS
  Bottom 0.406: IC1.18 65.69,43.2 U$4.4
D+
  Top 0.406: U$2.5 67.56,7.04 69,5.6 J1.D+
D-
  Top 0.406: J1.D- 68.55,4.95 66.3,7.21 U$2.6
GND  (via drill 0.35, 0.5)  (1 unrouted)
  Top 0.406: C1.2 66.35,25.11 C2.2 | C12.2 v44,29.4 | v50,29.5 C13.2 | U$2.1 72.64,7.34 72.6,7.3 73,6.9 J1.GND 75.1,6.9 v74.4,7.6 | C5.2 v51.9,4.1 | C9.2 v51.9,6.3 | VREG1.4 VREG1.5 VREG1.6 VREG1.7 VREG1.8 18.47,13.22 D2.2 v21.5,14.1
  Top 0.61: LED1.3-GND 5.75,83.65 v5.8,83.6 | LED2.3-GND 10.65,70.65 v10.7,70.6 | LED3.3-GND 18.65,62.65 v18.7,62.6 | LED4.3-GND 29.65,57.65 v29.7,57.6 | LED5.3-GND 47.65,57.65 v47.7,57.6 | LED6.3-GND 58.55,62.65 v58.7,62.5 | LED7.3-GND 66.65,70.65 v66.7,70.6 | LED8.3-GND 71.65,83.65 v71.7,83.6
  Top 0.813: C3.1 23.1,44 v22,44 | C15.C 26,40.1 v26,42 | v21,32 21.92,32 Q1.3 22.22,33.48 v22.2,33.5 | C64.C 13.5,35.5 v13,36 | v20,36 20,36.38 19.23,37.14 19.23,39.94 20,40.71 v20,42 | v30.2,33.4 30.22,33.38 Q3.3 v29.4,32.3 | C11.2 36.5,27.8 v36.4,27.7 | C4.2 55.9,24.8 v55.9,23.7 | C1.2 v63.31,23.91 v63.3,23.9 | C2.2 66.37,23.93 v66.4,23.9 | C8.2 v63.3,12.6
  Bottom 0.406: v44,29.4 44.3,29.4 44.5,29.2 45.8,29.2 46.5,29.9 47.6,29.9 48.3,29.2 49.7,29.2 v50,29.5
  other vias: 22.2,14.1 20.8,14.1
  pour Bottom (isolate 0.406, rank 6): 0,47 79,47 80,46 80,1 79,0 1,0 0,1
  pour Bottom (isolate 0.406, rank 6): 2,52 77,52 80,55 80,98 78,100 67,100 65,98 65,84 arc-171 15,84 15,98 13,100 2,100 0,98 0,54
  pour Top (no thermals): 20.5,12.6 22.5,12.6 22.5,14.4 20.5,14.4
GND1  (via drill 0.5)
  Top 0.813: LED20.3-GND 87.46,90.06 v87.46,89 | LED19.3-GND 87.46,83.06 v87.46,82 | LED18.3-GND 87.46,76.06 v87.46,75 | LED17.3-GND 87.46,69.06 v87.46,68 | LED16.3-GND 87.46,62.06 v87.46,61 | LED15.3-GND 87.46,55.06 v87.46,54 | LED14.3-GND 87.46,48.06 v87.46,47 | LED13.3-GND 87.46,41.06 v87.46,40 | LED12.3-GND 87.55,33.09 v87.46,33 | LED11.3-GND 87.55,26.09 v87.46,26 | LED10.3-GND 87.55,19.09 v87.46,19 | LED9.3-GND 87.55,12.09 v87.46,12
  Bottom 0.813: JP2.1 v87.46,12 v87.46,19 v87.46,26 v87.46,33 v87.46,40 v87.46,47 v87.46,54 v87.46,61 v87.46,68 v87.46,75 v87.46,82 v87.46,89 JP3.1
LINK1
  Top 0.813: LED1.4-DIN 5.35,80.35 7,82 7,85.6 7.1,85.6 arc128 7,94.4 7,98.1 JP6.2
LINK2
  Top 0.61: LED1.2-DOUT 12,81.1 12,69 10.35,67.35 LED2.4-DIN
LINK3
  Top 0.61: LED2.2-DOUT 20,65.1 20,61 18.35,59.35 LED3.4-DIN
LINK4
  Top 0.61: LED3.2-DOUT 26.25,62.65 31,57.9 31,56 29.35,54.35 LED4.4-DIN
LINK5
  Top 0.61: LED4.2-DOUT 43.25,57.65 LED5.4-DIN
LINK6
  Top 0.61: LED5.2-DOUT 55.85,57.65 LED6.4-DIN
LINK7
  Top 0.61: LED6.2-DOUT 65.55,65.75 LED7.4-DIN
LINK8
  Top 0.61: LED7.2-DOUT 70.45,80.25 LED8.4-DIN
LINK9
  Top 0.813: JP2.2 90,7.4 LED9.4-DIN
LINK10
  Top 0.813: LED9.2-DOUT LED10.4-DIN
LINK11
  Top 0.813: LED10.2-DOUT LED11.4-DIN
LINK12
  Top 0.813: LED11.2-DOUT LED12.4-DIN
LINK13
  Top 0.813: LED12.2-DOUT LED13.4-DIN
LINK14
  Top 0.813: LED13.2-DOUT LED14.4-DIN
LINK15
  Top 0.813: LED14.2-DOUT LED15.4-DIN
LINK16
  Top 0.813: LED15.2-DOUT LED16.4-DIN
N$1
  Top 0.406: R3.2 25.92,33.16 Q1.1
N$2  (via drill 0.35)
  Top 0.406: C6.1 72.1,12.1 v72.1,10 | v68.8,1.4 68.83,1.44 U$2.13
  Bottom 0.406: v72.1,10 72.1,4.7 v68.8,1.4
N$3
  Top 0.406: C1.1 60.51,27.39 Q2.2
  Bottom 0.406: IC1.9 60.61,30.45 Q2.2
N$4
  Top 1.27: J4.2 16.4,9 D3.A
N$5
  Top 0.406: C2.1 69.17,26.97 Q2.1
  Bottom 0.406: IC1.10 63.15,30.55 64.73,28.97 Q2.1
N$6
  Top 0.813: LED20.2-DOUT 91.35,90.15 90,91.5 JP3.2
N$7
  Top 0.813: LED16.2-DOUT LED17.4-DIN
N$8
  Top 0.813: LED17.2-DOUT LED18.4-DIN
N$9
  Top 0.406: U$2.7 65.03,6.83 62.9,4.7 59.9,4.7 59.2,4 12MHZ.1 57.5,3.6 56.69,2.79 54.71,2.79 C5.1
N$10
  Top 0.406: U$4.15 34.85,43 32.72,43 R4.2
N$11
  Top 0.406: U$2.8 63.76,6.66 62.6,5.5 59.9,5.5 59.2,6.2 12MHZ.2 59.19,7.6 C9.1
N$12
  Top 0.406: U$2.4 68.83,10.87 C8.1
N$13  (via drill 5 pad 8)
  other vias: 5,90
N$14  (via drill 5 pad 8)
  other vias: 5,60
N$15  (via drill 5 pad 8)
  other vias: 75,60
N$16  (via drill 5 pad 8)
  other vias: 75,90
N$17
  Top 0.813: LED18.2-DOUT LED19.4-DIN
N$18
  Top 0.813: LED19.2-DOUT LED20.4-DIN
N$82
  Top 0.406: R28.1 33.92,33.16 Q3.1
N$292
  pour Top (rank 3, no thermals): 22.6,16.4 19.4,16.4 19.3,16.5 19.2,16.6 19.2,19.7 19.2,19.9 19,20.1 17.9,20.1 17.7,19.9 17.7,17.3 17.6,17.2 16.8,17.2 16.7,17.3 16.7,28.3 20.7,28.3 20.7,18.2 21,17.9 22.6,17.9
PWRPANEL  (via drill 4)
  other vias: 24,85 56,85
  pour Bottom: 20,90 20,91 22,93 58,93 60,91 60,79 58,77 22,77 20,79
  pour Top: 20,90 20,91 22,93 58,93 60,91 60,79 58,77 22,77 20,79
RESET  (via drill 0.35)
  Top 0.406: IC1.1 37.76,33.44 36.2,35 36.2,37.7 35.6,38.3 33.9,38.3 33.4,38.8 33.4,39.48 R2.1 | C6.2 71.7,16.5 71.7,19 72.4,19.7 | v72.8,25.6 72.6,25.4 72.6,22.9 71.7,22 71.7,20.4 72.4,19.7 | S1.1 76.32,19.7 72.4,19.7
  Bottom 0.406: IC1.1 40.29,32.99 39.6,32.3 39.6,28.2 41.4,26.4 60.1,26.4 60.8,25.7 72.7,25.7 v72.8,25.6
SCL
  Bottom 0.406: IC1.28 40.29,40.59 39.1,39.4 16.3,39.4 15.5,40.2 15.5,42.99 JP5.4
SDA
  Bottom 0.406: IC1.27 42.83,40.23 41.3,38.7 16,38.7 14.8,39.9 14.8,43 14.07,43.73 JP5.3
VUSB  (via drill 0.35)
  Top 0.406: J1.VBUS 73.2,4.3 v72.95,4.05 72.64,3.75 U$2.16 | v69.1,11.8 69.4,12.1 69.4,18.6 68.6,19.4 D11.A
  Bottom 0.406: v72.95,4.05 72.8,4.2 72.8,9.26 73.13,9.6 73.13,10.57 72.5,11.2 69.7,11.2 v69.1,11.8

### Text on the board
tPlace: GND | SIG | 5V | I2C | GND | 5V | SDA | SCL | ATMEGA328 | LED- | SGL | 5V | RESET | COM | GND | SIG | N/O | DBL | GND | SELECTOR | LED+ | NEOPIXELS | GO SWITCH | CH340 | POWER | PUMP | + | - | + | -
bPlace: GND | SIG | 5V | GND | SIG | 5V | OUT | WS2812 ADDR RGB LEDS | x12 | IN | CONTRAST | CALIBRATE | GND | SIG | 5V | + | - | + | - | If LCD is unreadable, adjust Contrast | BarRobots v1.1 | Adjust Calibration to tune shot size / to exactly 1 unit (test using single)
tStop: POWER | 12V | + | -